# EAGLE design Buksir v1.1 (EAGLE 9.4.2)
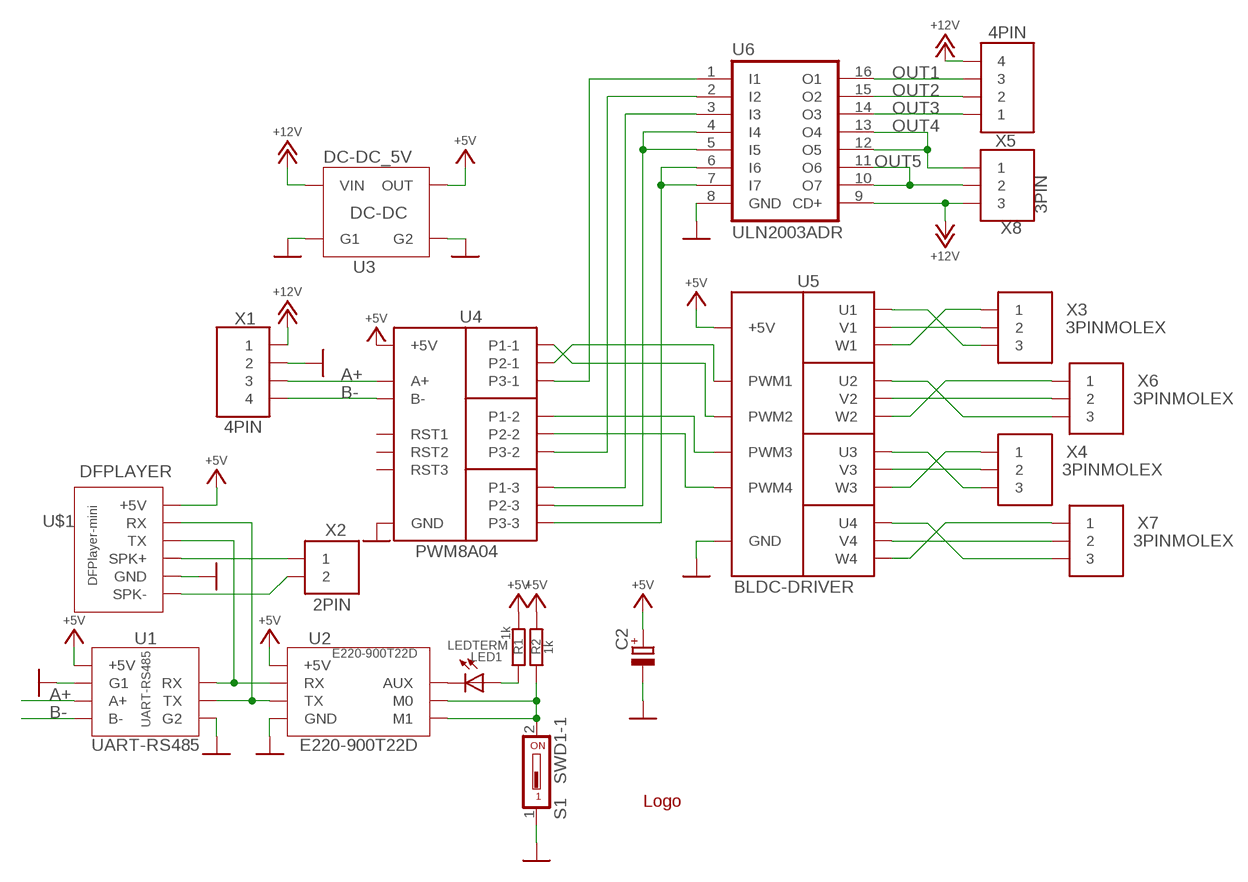
[diagram p0: schematic, sheet 1]

## Parts
C2  CAP_POL12  [E3.5-8_R]
LED1  LEDTERM  [LED_TERM]
R1  1k  RESISTOR0805  [R0805]
R2  1k  RESISTOR0805  [R0805]
S1  SWD1-1  DS01  [DS-01]
U1  UART-RS485  [UART-RS485]
U2  E220-900T22D  [E220-900T22D]
U3  DC-DC_5V  [DC-DC_5V]
U4  PWM8A04  [PWM8A04]
U5  BLDC-DRIVER  [BLDC-DRIVER]
U6  ULN2003ADR  [SOIC-16]
U$1  DFPLAYER  [MP3-PLAYER]
U$2  LOGO  [LOGO]
X1  4PIN  [4PIN-2.5MM]
X2  2PIN  [2PIN-2.5MM]
X3  3PINMOLEX  [3PIN-MOLEX]
X4  3PINMOLEX  [3PIN-MOLEX]
X5  4PIN  [4PIN-2.5MM]
X6  3PINMOLEX  [3PIN-MOLEX]
X7  3PINMOLEX  [3PIN-MOLEX]
X8  3PIN  [3PIN-2.5MM]

## Nets
+5V: C2.+ R1.2 R2.2 U1.VCC(+5V) U2.VCC(+5V) U3.OUT U4.+V(+5V) U5.B+(+5V) U$1.VCC(+5V)
A+: U1.A+ U4.A+ X1.P$2
B-: U1.B- U4.B- X1.P$1
GND: C2.- S1.1 U1.G1 U1.G2 U2.GND U3.G1 U3.G2 U4.GND U5.B-(GND) U6.8(GND) U$1.GND X1.P$3
N$1: U4.P3-2 U6.2(I2)
N$2: U1.TX U2.TXD(TX) U$1.RX
N$3: LED1.K(C) U2.AUX
N$4: LED1.A R1.1
N$5: R2.1 S1.2 U2.M0 U2.M1
N$9: U4.P2-2 U5.PWM4
N$10: U$1.S+(SPK+) X2.P$1
N$11: U4.P1-2 U5.PWM3
N$12: U4.P1-1 U5.PWM2
N$13: U5.U1 X3.P$3
N$14: U5.V1 X3.P$2
N$15: U5.W1 X3.P$1
N$16: U5.W2 X6.P$1
N$17: U5.U2 X6.P$3
N$18: U5.V2 X6.P$2
N$19: U5.W3 X4.P$1
N$20: U5.U3 X4.P$3
N$21: U5.V3 X4.P$2
N$22: U5.U4 X7.P$3
N$23: U5.W4 X7.P$1
N$24: U5.V4 X7.P$2
N$25: U4.P2-1 U5.PWM1
N$28: U4.P1-3 U6.3(I3)
N$29: U$1.S-(SPK-) X2.P$2
N$32: U1.RX U2.RXD(RX) U$1.TX
OUT1: U6.16(O1) X5.P$2
OUT2: U6.15(O2) X5.P$3
OUT3: U6.14(O3) X5.P$4
OUT4: U6.12(O5) U6.13(O4) X8.P$1
OUT5: U6.10(O7) U6.11(O6) X8.P$2
P3-1: U4.P3-1 U6.1(I1)
P3-2: U4.P2-3 U6.4(I4) U6.5(I5)
P3-3: U4.P3-3 U6.6(I6) U6.7(I7)
V_IN: U3.VIN U6.9(CD+) X1.P$4 X5.P$1 X8.P$3 ; supply symbol labelled +12V
Unconnected: U4.RST1 U4.RST2 U4.RST3

## Library data of the parts
C2 = !!!WirenBoard:CAP_POL
LED1 = !!!WirenBoard:LED
R1 R2 = !!!WirenBoard:RESISTOR: C17471
S1 = switch-dil:DS01: DIL/CODE SWITCH; OC_FARNELL: unknown; OC_NEWARK: unknown
U1 = buksir:UART-RS485
U2 = buksir:E220-900T22D
U3 = buksir:DC-DC_5V
U4 = buksir:PWM8A04
U5 = buksir:BLDC-DRIVER
U6 = !WB_IC:ULN2003ADR
U$1 = buksir:DFPLAYER
U$2 = buksir:LOGO
X1 X5 = buksir:4PIN
X2 = buksir:2PIN
X3 X4 X6-X8 = buksir:3PIN

## Board
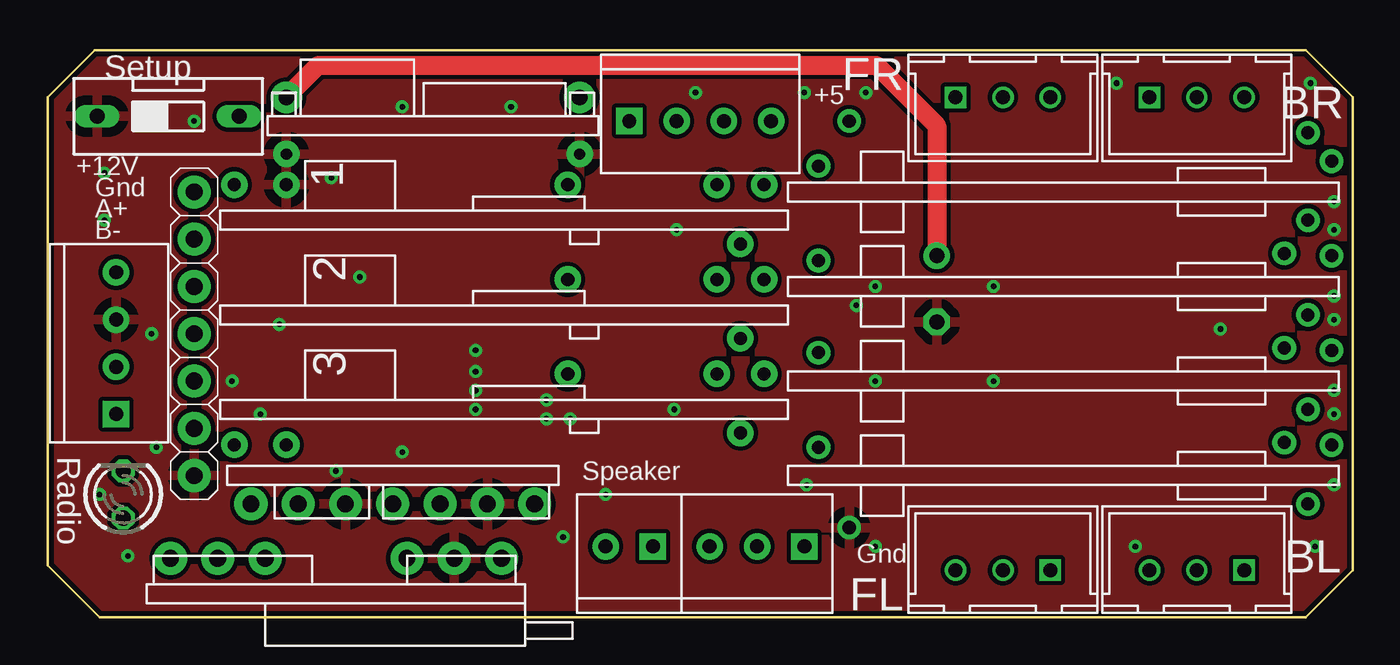
[diagram p1: board, top side]
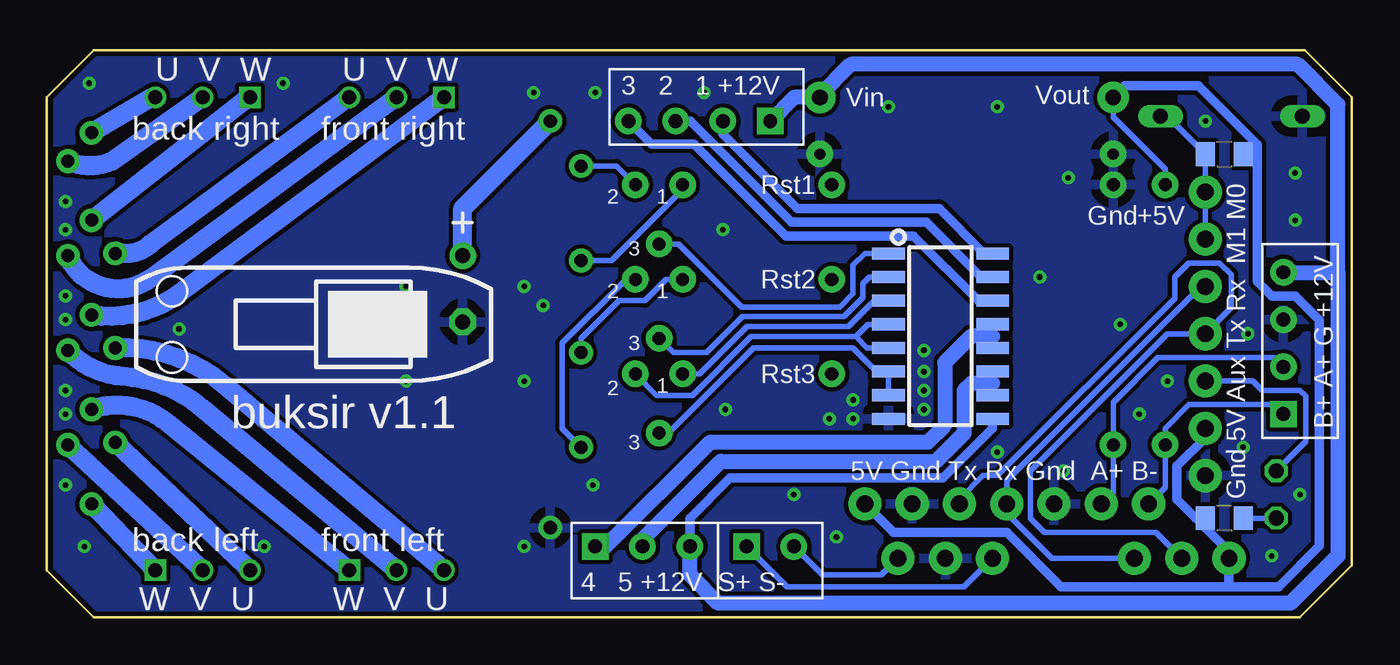
[diagram p2: board, bottom side, seen from below]

Size 70.1 x 30.48 mm. Coordinates in mm from the lower left corner, seen from the top.
Outline: 0,27.94 0,2.79 2.79,0 67.56,0 70.1,2.54 70.1,27.94 67.56,30.48 2.54,30.48 0,27.94
Copper layers (1*16): Top 0.035mm / dielectric 0.2mm / Bottom 0.035mm
Design rules "WB-2l-35um": minimum track width 0.25mm, minimum drill 0.3mm, track to track 9mil, track to pad 9mil, pad to pad 9mil, via to via 9mil, smd to smd 9mil, copper to edge 10mil, drill to drill 10mil, minimum pad ring 0.2mm, minimum via ring 0.2mm, stop-mask expansion 0.05mm, vias tented up to drill 0.3mm, thermal gap 20mil

### Footprints (pad centres in the part's own frame; a part is rotated, then mirrored left to right if it is on the bottom)
E3.5-8_R = drill 0.8 pad 1.422: + -1.778,3.81 | drill 0.8 pad 1.422 octagon: - 1.778,3.81
LED_TERM = drill 0.813 octagon: A -1.27,0; K 1.27,0
R0805 = smd 1.016 x 1.27: 1 -1.016,0; 2 1.016,0
DS-01 = drill 0.813 long: 1 0,-3.81; 2 0,3.81
UART-RS485 = drill 0.9 pad 1.778: A+ 13.97,2.032; B- 16.51,2.032; G1 3.81,2.032; G2 11.43,2.032; RX 8.89,2.032; TX 6.35,2.032; VCC 1.27,2.032
E220-900T22D = drill 0.9 pad 1.778: AUX 1.524,-2.54; GND 1.524,-7.62; M0 1.524,7.62; M1 1.524,5.08; RXD 1.524,2.54; TXD 1.524,0; VCC 1.524,-5.08
DC-DC_5V = drill 0.6 pad 1.422: G1 1.016,1.016; G2 16.764,1.016 | drill 0.85 pad 1.676: OUT 16.764,-2.032; VIN 1.016,-2.032
PWM8A04 = drill 0.7 pad 1.422: +V 0.762,6.985; A+ 3.556,-6.985; B- 0.762,-6.985; GND 3.556,6.985; P1-1 26.67,6.985; P1-2 26.67,1.905; P1-3 26.67,-3.175; P2-1 29.21,6.985; P2-2 29.21,1.905; P2-3 29.21,-3.175; P3-1 27.94,3.81; P3-2 27.94,-1.27; P3-3 27.94,-6.35; RST1 18.669,6.985; RST2 18.669,-3.175; RST3 18.669,1.905
BLDC-DRIVER = drill 0.7 pad 1.27: B+ 2.032,11.43; B- 2.032,-10.414; PWM1 0.381,9.017; PWM2 0.381,3.937; PWM3 0.381,-1.016; PWM4 0.381,-6.096; U1 26.67,10.795; U2 25.4,4.318; U3 25.4,-0.762; U4 25.4,-5.842; V1 27.94,9.271; V2 27.94,4.191; V3 27.94,-0.889; V4 27.94,-5.969; W1 26.67,6.096; W2 26.67,1.016; W3 26.67,-4.064; W4 26.67,-9.144
SOIC-16 = smd 0.65 x 1.75: 1 -4.445,-2.794; 2 -3.175,-2.794; 3 -1.905,-2.794; 4 -0.635,-2.794; 5 0.635,-2.794; 6 1.905,-2.794; 7 3.175,-2.794; 8 4.445,-2.794; 9 4.445,2.794; 10 3.175,2.794; 11 1.905,2.794; 12 0.635,2.794; 13 -0.635,2.794; 14 -1.905,2.794; 15 -3.175,2.794; 16 -4.445,2.794
MP3-PLAYER = drill 0.9 pad 1.778: GND 16.51,1.905; RX 3.81,1.905; S+ 13.97,1.905; S- 19.05,1.905; TX 6.35,1.905; VCC 1.27,1.905
4PIN-2.5MM = drill 0.75 pad 1.422 square: P$1 -3.81,0 | drill 0.75 pad 1.422: P$2 -1.27,0; P$3 1.27,0; P$4 3.81,0
2PIN-2.5MM = drill 0.75 pad 1.422 square: P$1 -1.27,0 | drill 0.75 pad 1.422: P$2 1.27,0
3PIN-MOLEX = drill 0.75 square: P$1 -2.54,0 | drill 0.75: P$2 0,0; P$3 2.54,0
3PIN-2.5MM = drill 0.75 pad 1.422 square: P$1 -2.54,0 | drill 0.75 pad 1.422: P$2 0,0; P$3 2.54,0

### Placement (x,y rotation side)
C2  51.56,17.65 270 bottom
LED1  4.06,6.6 90 top
R1  6.86,5.33 180 bottom
R2  6.86,24.89 0 bottom
S1  6.48,26.92 270 top
U1  27.43,8.13 180 top
U2  6.35,15.24 0 top
U3  29.59,25.91 180 top
U4  9.27,16.26 0 top
U5  41.02,15.24 0 top
U6  22.1,15.11 270 bottom
U$1  5.33,1.27 0 top
U$2  47.5,15.75 0 bottom
X1  3.68,14.73 90 top
X2  31.24,3.81 180 top
X3  61.72,27.94 0 top
X4  51.31,2.54 180 top
X5  35.05,26.67 0 top
X6  51.31,27.94 0 top
X7  61.72,2.54 180 top
X8  38.1,3.81 180 top

### Tracks (layer width: path | path; a pad name or v marks a point on that pad's centre or on a via)
+5V
  Top 1.016: U3.OUT 14.54,29.66 44.51,29.66 47.75,26.42 C2.+
  Bottom 0.305: R2.2 5.08,24.89 | U3.OUT 12.83,26.88 10.03,24.09 U4.+V
  Bottom 0.508: U3.OUT 12.19,28.58 8.26,28.58 5.08,25.4 5.08,24.89 5.08,18.03 4.32,17.27 3.05,17.27 1.75,15.98 1.75,3.83 3.94,1.65 6.6,1.65 | U2.VCC 7.87,9.65 9.4,8.13 9.4,6.35 8.38,5.33 R1.2 7.87,4.83 6.6,3.56 U$1.VCC 6.6,1.65 | U1.VCC 24.64,4.57 18.54,4.57 15.62,1.65 6.6,1.65
  Bottom 1.016: C2.+ 47.75,21.97 U5.B+
A+
  Bottom 0.305: X1.P$2 4.19,13.97 10.41,13.97 12.83,11.56 U4.A+ 12.83,6.73 U1.A+
B-
  Bottom 0.305: X1.P$1 4.19,11.43 8.76,11.43 10.03,10.16 U4.B- 10.03,6.98 U1.B-
GND  (via drill 0.3)
  other vias: 3.05,23.88 3.05,21.34 5.59,15.24 5.84,9.14 4.32,3.3 44.45,3.81 44.45,12.7 44.45,17.78 50.8,17.78 58.42,3.81 68.07,3.81 67.82,28.7 57.4,28.7 43.94,28.19 2.79,6.6 7.87,26.67 50.8,12.7 62.99,15.49 69.09,22.35 69.09,20.83 69.09,17.27 69.09,16 69.09,12.19 69.09,10.92 69.09,7.11 11.43,10.92 15.49,7.87 19.05,27.43 15.24,23.62 24.89,27.43 34.8,28.19 40.64,28.19 22.99,14.35 22.99,11.18 12.45,15.75 16.76,18.29 27.69,4.32 29.97,6.6 33.78,20.83 43.43,16.76 9.91,12.7 26.8,10.67 33.66,11.18 40.77,7.11 19.05,8.89 26.8,11.68 22.99,13.21 28.07,10.67 22.99,12.19
  pour Bottom: -0.51,31.24 70.61,31.24 70.61,-0.25 -0.51,-0.25
  pour Top: -0.51,31.24 70.61,31.24 70.61,-0.25 -0.51,-0.25
N$1
  Bottom 0.305: U4.P3-2 36.45,14.22 34.67,14.22 32.74,16.15 27.29,16.15 26.26,17.18 26.26,17.93 25.91,18.29 U6.2
N$2
  Bottom 0.305: U1.TX 21.08,6.35 19.81,7.62 19.05,7.62 9.53,17.14 9.53,18.29 8.76,19.05 7.11,19.05 6.48,18.42 6.48,16.64 U2.TXD 9.91,15.24 17.27,7.87 17.27,5.33 16.51,4.57 10.54,4.57 U$1.RX
N$3
  Bottom 0.305: U2.AUX 5.33,12.7 4.83,12.19 2.79,12.19 2.49,11.89 2.49,9.45 LED1.K
N$4
  Bottom 0.305: R1.1 LED1.A
N$5
  Bottom 0.305: S1.2 9.91,26.92 R2.1 U2.M0 U2.M1
N$9
  Bottom 0.305: U4.P2-2 38.99,18.16 42.42,14.73 42.42,10.16 U5.PWM4
N$10
  Bottom 0.305: U$1.S+ 20.83,1.65 30.35,1.65 X2.P$1
N$11
  Bottom 0.305: U4.P1-2 36.83,18.16 37.97,17.02 39.37,17.02 41.4,14.99 U5.PWM3
N$12
  Bottom 0.305: U4.P1-1 35.94,22.99 39.75,19.18 U5.PWM2
N$13
  Bottom 1.016: U5.U1 64.44,27.94 X3.P$3
N$14
  Bottom 1.016: X3.P$2 66.58,24.51 arc48 U5.V1
N$15
  Bottom 1.016: U5.W1 59.25,27.94 X3.P$1
N$16
  Bottom 1.016: X6.P$1 62.99,17.39 arc46 U5.W2
N$17
  Bottom 1.016: X6.P$3 64.52,20.07 arc45 65.74,19.56 U5.U2
N$18
  Bottom 1.016: X6.P$2 64.52,18.22 arc103 U5.V2
N$19
  Bottom 1.016: X4.P$1 63.58,10.43 arc-57 U5.W3
N$20
  Bottom 1.016: X4.P$3 60.53,12.47 arc-43 U5.U3
N$21
  Bottom 1.016: X4.P$2 61.74,11.23 arc-36 66.04,12.95 arc44 U5.V3
N$22
  Bottom 1.016: U5.U4 59.44,2.79 X7.P$3
N$23
  Bottom 1.016: U5.W4 64.27,2.54 X7.P$1
N$24
  Bottom 1.016: U5.V4 61.98,2.79 X7.P$2
N$25
  Bottom 0.305: U4.P2-1 39.5,24.26 U5.PWM1
N$28
  Bottom 0.305: U4.P1-3 35.04,13.08 32.5,15.62 27.05,15.62 25.65,17.02 U6.3
N$29
  Bottom 0.305: U$1.S- 25.27,2.29 28.45,2.29 X2.P$2
N$32
  Bottom 0.305: U2.RXD 8.13,17.78 18.54,7.37 U1.RX 18.54,5.59 16.13,3.17 U$1.TX
OUT1
  Bottom 0.508: U6.16 19.76,19.56 22.17,21.97 29.79,21.97 33.78,25.96 X5.P$2
OUT2
  Bottom 0.508: X5.P$3 35.53,26.67 30.09,21.23 22.86,21.23 19.92,18.29 U6.15
OUT3
  Bottom 0.508: X5.P$4 37.62,25.43 35.33,25.43 30.4,20.49 23.54,20.49 20.07,17.02 U6.14
OUT4
  Bottom 0.508: U6.12 19.3,15.11 U6.13
  Bottom 0.813: 19.3,15.11 20.45,15.11 21.87,13.69 21.87,10.32 22.77,9.43 34.46,9.43 40.08,3.81 X8.P$1
OUT5
  Bottom 0.508: U6.11 19.3,12.57 U6.10
  Bottom 0.813: 19.3,12.57 20.45,12.57 20.83,12.19 20.83,9.89 22.33,8.39 33.9,8.39 38.1,4.19 X8.P$2
P3-1
  Bottom 0.305: U4.P3-1 36.17,20.07 32.8,16.69 27.51,16.69 26.8,17.4 26.8,18.92 26.16,19.56 U6.1
P3-2
  Bottom 0.305: U6.5 26.04,14.48 26.64,15.09 | U4.P2-3 37.34,11.94 35.42,11.94 32.28,15.09 26.64,15.09 | 26.64,15.09 25.98,15.75 U6.4
P3-3
  Bottom 0.305: U6.7 U6.6 25.53,13.21 26.8,14.48 32.13,14.48 36.7,9.91 U4.P3-3
V_IN
  Bottom 0.508: U6.9 19.3,10.16 21.97,7.5 33.4,7.5 35.56,5.33 35.56,3.56
  Bottom 0.813: X1.P$4 0.76,18.54 | 0.76,18.54 0.76,27.56 2.92,29.72 26.92,29.72 28.57,28.07 U3.VIN 29.97,27.94 X5.P$1 | 0.76,18.54 0.76,3.3 3.3,0.76 34.04,0.76 35.56,2.29 35.56,3.56 X8.P$3

### Text on the board
tPlace: FR | Setup | BR | +5 | +12V | 1 | Gnd | A+ | B- | 2 | 3 | Radio | Speaker | BL | Gnd | FL
bPlace: U V W | U V W | 3 2 1 +12V | Vout | Vin | front right | back right | Rst1 | 1 | 2 | +5V | Gnd | 3 | Rst2 | 1 | 2 | 3 | Rst3 | 1 | 2 | B+ A+ G +12V | buksir v1.1 | 3 | 5V Gnd Tx Rx Gnd A+ B- | Gnd 5V Aux Tx Rx M1 M0 | front left | back left | 4 5 +12V S+ S- | W V U | W V U
bCarbon: R2 | Q1 | R3 | C1 | Q2 | C3 | Q3 | R1